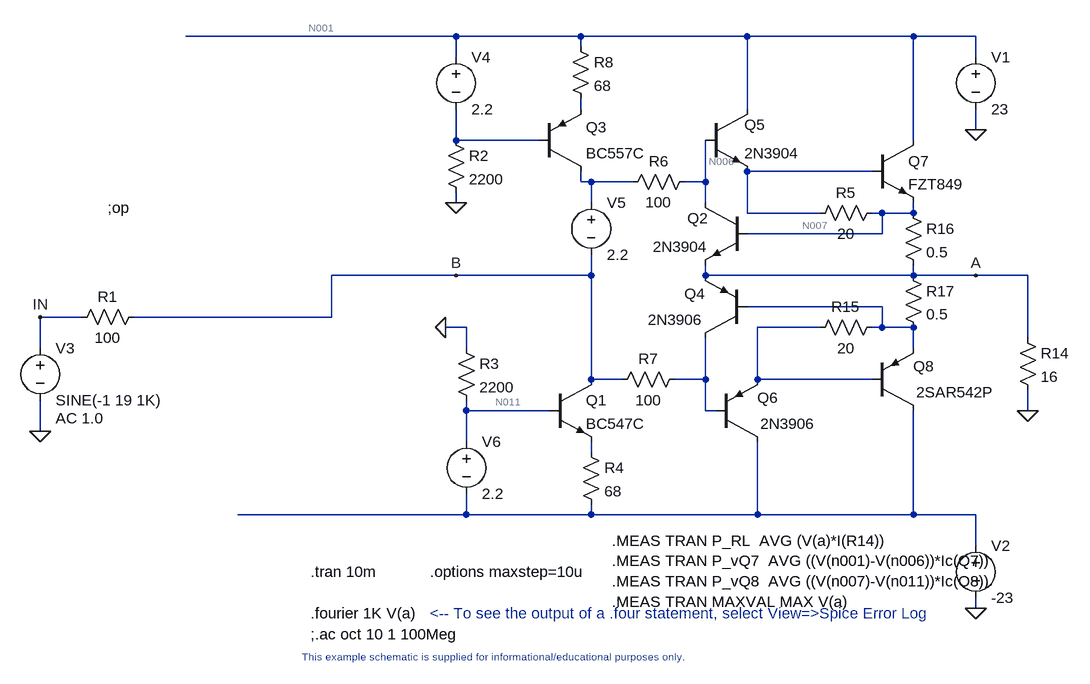
[diagram p0: schematic audioampFH2.asc]
audioampFH2.asc, the LTspice schematic file:
Version 4
SHEET 1 2516 2032
WIRE 1200 928 784 928
WIRE 1392 928 1200 928
WIRE 1648 928 1392 928
WIRE 1904 928 1648 928
WIRE 2000 928 1904 928
WIRE 1392 944 1392 928
WIRE 1200 960 1200 928
WIRE 2000 960 2000 928
WIRE 1392 1040 1392 1024
WIRE 1648 1040 1648 928
WIRE 2000 1072 2000 1040
WIRE 1200 1088 1200 1040
WIRE 1328 1088 1200 1088
WIRE 1904 1088 1904 928
WIRE 1840 1136 1648 1136
WIRE 1392 1152 1392 1136
WIRE 1408 1152 1392 1152
WIRE 1472 1152 1408 1152
WIRE 1584 1152 1584 1088
WIRE 1584 1152 1552 1152
WIRE 1200 1184 1200 1168
WIRE 1408 1184 1408 1152
WIRE 1584 1184 1584 1152
WIRE 1648 1200 1648 1136
WIRE 1760 1200 1648 1200
WIRE 1856 1200 1840 1200
WIRE 1904 1200 1904 1184
WIRE 1904 1200 1856 1200
WIRE 1856 1232 1856 1200
WIRE 1856 1232 1648 1232
WIRE 1200 1296 1008 1296
WIRE 1408 1296 1408 1264
WIRE 1408 1296 1200 1296
WIRE 1584 1296 1584 1280
WIRE 1904 1296 1904 1280
WIRE 1904 1296 1584 1296
WIRE 2000 1296 1904 1296
WIRE 2080 1296 2000 1296
WIRE 1856 1344 1648 1344
WIRE 624 1360 560 1360
WIRE 1008 1360 1008 1296
WIRE 1008 1360 704 1360
WIRE 1216 1376 1184 1376
WIRE 1760 1376 1664 1376
WIRE 1856 1376 1856 1344
WIRE 1856 1376 1840 1376
WIRE 1904 1376 1856 1376
WIRE 2080 1392 2080 1296
WIRE 560 1408 560 1360
WIRE 1216 1408 1216 1376
WIRE 1904 1408 1904 1376
WIRE 1408 1456 1408 1296
WIRE 1456 1456 1408 1456
WIRE 1584 1456 1584 1392
WIRE 1584 1456 1536 1456
WIRE 1664 1456 1664 1376
WIRE 1840 1456 1664 1456
WIRE 1216 1504 1216 1488
WIRE 1344 1504 1216 1504
WIRE 1584 1504 1584 1456
WIRE 1600 1504 1584 1504
WIRE 2080 1504 2080 1472
WIRE 560 1536 560 1488
WIRE 1216 1552 1216 1504
WIRE 1408 1568 1408 1552
WIRE 1216 1664 1216 1632
WIRE 1216 1664 864 1664
WIRE 1408 1664 1408 1648
WIRE 1408 1664 1216 1664
WIRE 1664 1664 1664 1552
WIRE 1664 1664 1408 1664
WIRE 1904 1664 1904 1504
WIRE 1904 1664 1664 1664
WIRE 2000 1664 1904 1664
WIRE 2000 1712 2000 1664
WIRE 2000 1808 2000 1792
FLAG 2000 1072 0
FLAG 2000 1808 0
FLAG 2080 1504 0
FLAG 560 1536 0
FLAG 560 1360 IN
FLAG 1200 1184 0
FLAG 1184 1376 0
FLAG 2000 1296 A
FLAG 1200 1296 B
SYMBOL NPN 1584 1040 R0
WINDOW 0 60 24 Left 2
WINDOW 3 60 68 Left 2
SYMATTR InstName Q5
SYMATTR Value 2N3904
SYMBOL npn 1840 1088 R0
SYMATTR InstName Q7
SYMATTR Value FZT849
SYMBOL PNP 1600 1552 M180
WINDOW 0 64 68 Left 2
WINDOW 3 68 28 Left 2
SYMATTR InstName Q6
SYMATTR Value 2N3906
SYMBOL VOLTAGE 2000 944 R0
WINDOW 123 0 0 Left 2
WINDOW 39 0 0 Left 2
SYMATTR InstName V1
SYMATTR Value 23
SYMBOL voltage 2000 1696 R0
WINDOW 123 0 0 Left 2
WINDOW 39 0 0 Left 2
SYMATTR InstName V2
SYMATTR Value -23
SYMBOL res 2064 1376 R0
SYMATTR InstName R14
SYMATTR Value 16
SYMBOL pnp 1328 1136 M180
WINDOW 0 72 68 Left 2
WINDOW 3 72 28 Left 2
SYMATTR InstName Q3
SYMATTR Value BC557C
SYMBOL voltage 560 1392 R0
WINDOW 123 24 124 Left 2
WINDOW 39 0 0 Left 2
SYMATTR Value2 AC 1.0
SYMATTR InstName V3
SYMATTR Value SINE(-1 19 1K)
SYMBOL res 720 1344 R90
WINDOW 0 0 56 VBottom 2
WINDOW 3 32 56 VTop 2
SYMATTR InstName R1
SYMATTR Value 100
SYMBOL res 1376 928 R0
SYMATTR InstName R8
SYMATTR Value 68
SYMBOL PNP 1840 1504 M180
WINDOW 0 64 68 Left 2
WINDOW 3 68 28 Left 2
SYMATTR InstName Q8
SYMATTR Value 2SAR542P
SYMBOL res 1856 1360 R90
WINDOW 0 0 56 VBottom 2
WINDOW 3 32 56 VTop 2
SYMATTR InstName R15
SYMATTR Value 20
SYMBOL res 1888 1184 R0
SYMATTR InstName R16
SYMATTR Value 0.5
SYMBOL res 1888 1280 R0
SYMATTR InstName R17
SYMATTR Value 0.5
SYMBOL VOLTAGE 1200 944 R0
WINDOW 123 0 0 Left 2
WINDOW 39 0 0 Left 2
SYMATTR InstName V4
SYMATTR Value 2.2
SYMBOL res 1184 1072 R0
SYMATTR InstName R2
SYMATTR Value 2200
SYMBOL VOLTAGE 1408 1168 R0
WINDOW 123 0 0 Left 2
WINDOW 39 0 0 Left 2
SYMATTR InstName V5
SYMATTR Value 2.2
SYMBOL VOLTAGE 1216 1536 R0
WINDOW 123 0 0 Left 2
WINDOW 39 0 0 Left 2
SYMATTR InstName V6
SYMATTR Value 2.2
SYMBOL res 1200 1392 R0
SYMATTR InstName R3
SYMATTR Value 2200
SYMBOL res 1392 1552 R0
SYMATTR InstName R4
SYMATTR Value 68
SYMBOL npn 1344 1456 R0
SYMATTR InstName Q1
SYMATTR Value BC547C
SYMBOL res 1856 1184 R90
WINDOW 0 0 56 VBottom 2
WINDOW 3 32 56 VTop 2
SYMATTR InstName R5
SYMATTR Value 20
SYMBOL NPN 1648 1184 M0
WINDOW 0 60 24 Left 2
WINDOW 3 60 68 Left 2
SYMATTR InstName Q2
SYMATTR Value 2N3904
SYMBOL PNP 1648 1392 R180
WINDOW 0 64 68 Left 2
WINDOW 3 68 28 Left 2
SYMATTR InstName Q4
SYMATTR Value 2N3906
SYMBOL res 1568 1136 R90
WINDOW 0 0 56 VBottom 2
WINDOW 3 32 56 VTop 2
SYMATTR InstName R6
SYMATTR Value 100
SYMBOL res 1552 1440 R90
WINDOW 0 0 56 VBottom 2
WINDOW 3 32 56 VTop 2
SYMATTR InstName R7
SYMATTR Value 100
TEXT 976 1752 Left 2 !.tran 10m
TEXT 1160 1752 Left 2 !.options maxstep=10u
TEXT 976 1848 Left 2 !;.ac oct 10 1 100Meg
TEXT 1248 1872 Top 1 ;This example schematic is supplied for informational/educational purposes only.
TEXT 976 1816 Left 2 !.fourier 1K V(a)
TEXT 1160 1816 Left 2 ;<-- To see the output of a .four statement, select View=>Spice Error Log
TEXT 1440 1704 Left 2 !.MEAS TRAN P_RL  AVG (V(a)*I(R14))\n.MEAS TRAN P_vQ7  AVG ((V(n001)-V(n006))*Ic(Q7))\n.MEAS TRAN P_vQ8  AVG ((V(n007)-V(n011))*Ic(Q8))\n.MEAS TRAN MAXVAL MAX V(a)
TEXT 664 1192 Left 2 !;op

The netlist it stands for:
* audioampFH2.asc
Q5 N001 N006 N004 0 2N3904
Q7 N001 N004 N007 0 FZT849
Q6 N013 N010 N009 0 2N3906
V1 N001 0 23
V2 N013 0 -23
R14 A 0 16
Q3 N005 N003 N002 0 BC557C
V3 IN 0 SINE(-1 19 1K) AC 1.0
R1 B IN 100
R8 N001 N002 68
Q8 N013 N009 N008 0 2SAR542P
R15 N008 N009 20
R16 N007 A 0.5
R17 A N008 0.5
V4 N001 N003 2.2
R2 N003 0 2200
V5 N005 B 2.2
V6 N011 N013 2.2
R3 0 N011 2200
R4 N012 N013 68
Q1 B N011 N012 0 BC547C
R5 N007 N004 20
Q2 N006 N007 A 0 2N3904
Q4 N010 N008 A 0 2N3906
R6 N006 N005 100
R7 N010 B 100
.model NPN NPN
.model PNP PNP
.lib standard.bjt
.tran 10m
.options maxstep=10u
;.ac oct 10 1 100Meg
* This example schematic is supplied for informational/educational purposes only.
.fourier 1K V(a)
* <-- To see the output of a .four statement, select View=>Spice Error Log
.MEAS TRAN P_RL  AVG (V(a)*I(R14))
.MEAS TRAN P_vQ7  AVG ((V(n001)-V(n006))*Ic(Q7))
.MEAS TRAN P_vQ8  AVG ((V(n007)-V(n011))*Ic(Q8))
.MEAS TRAN MAXVAL MAX V(a)
;op
.backanno
.end